# EAGLE design controller (EAGLE 6.4)
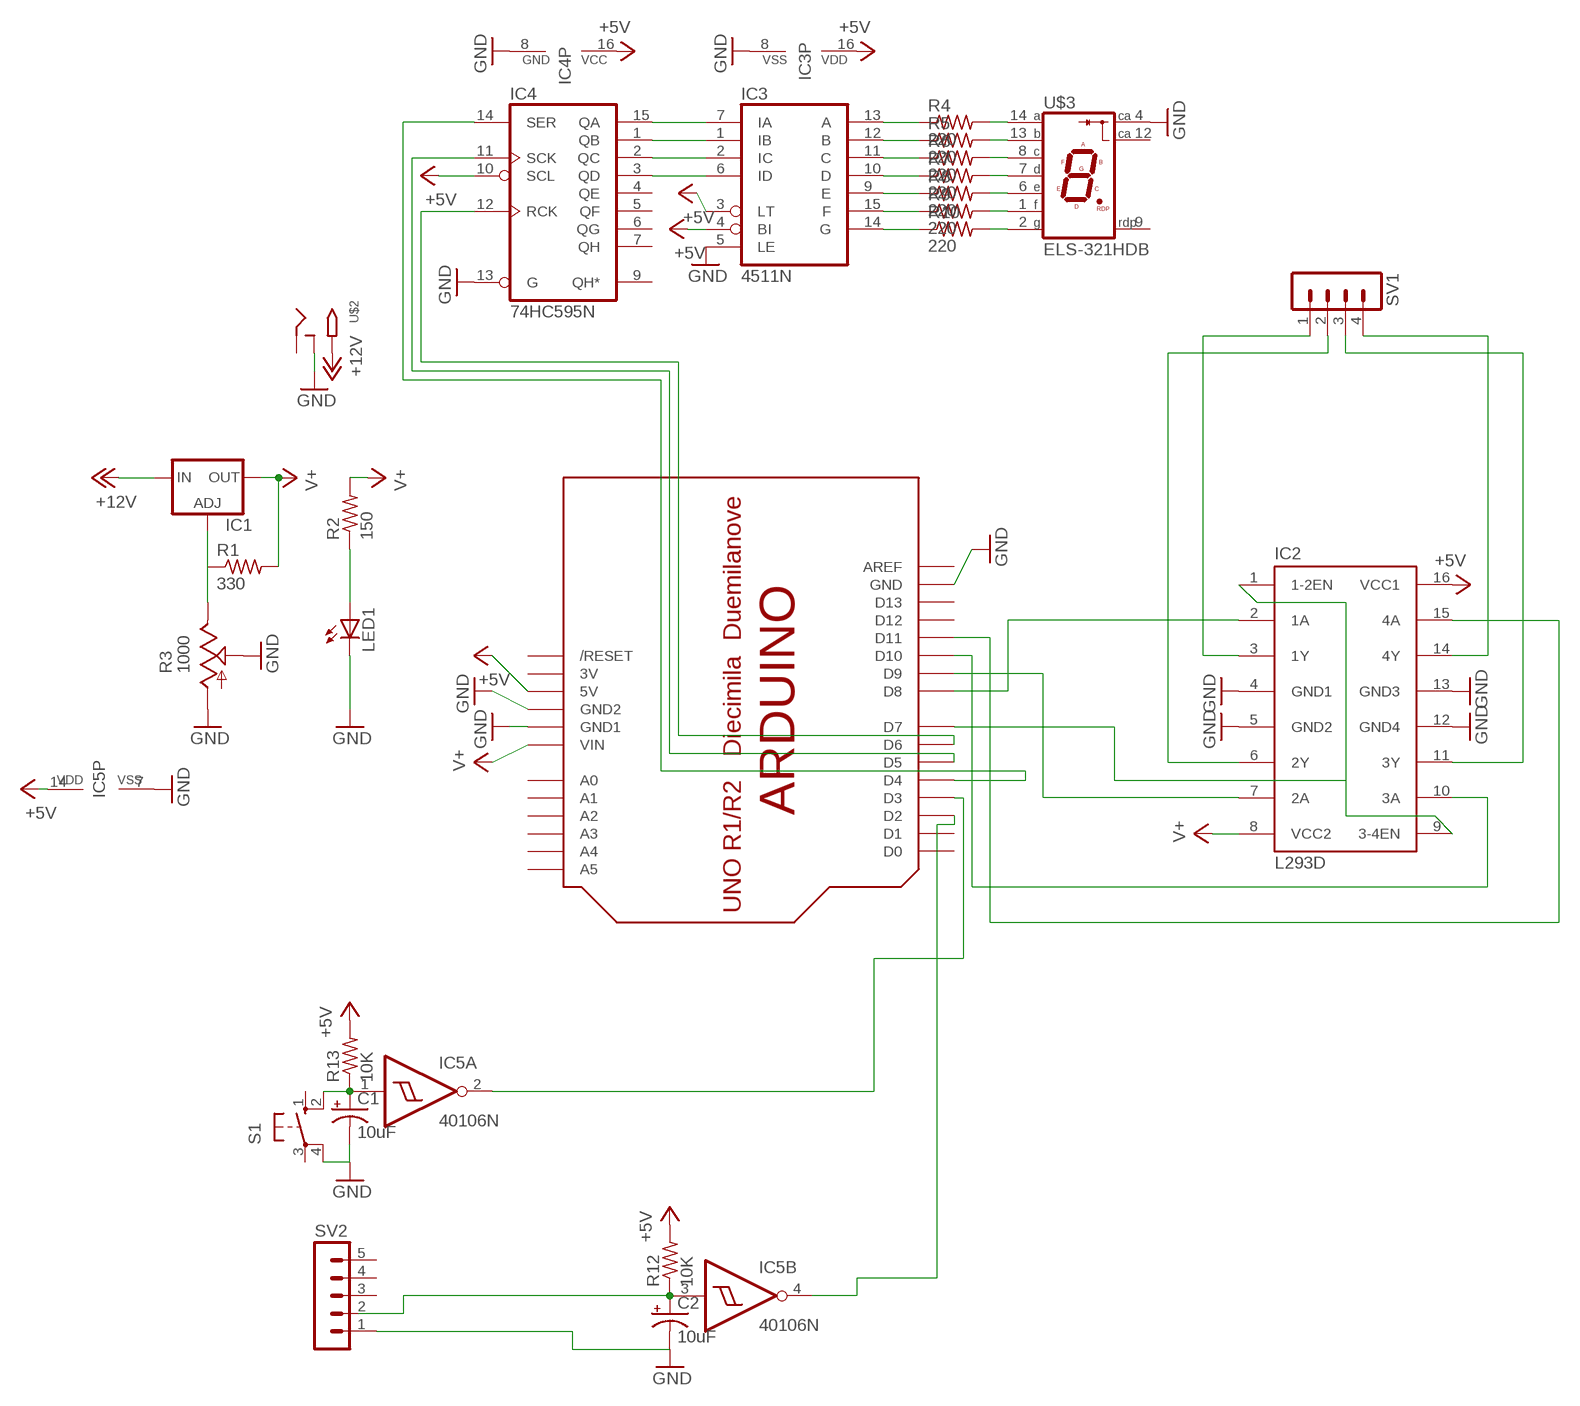
[diagram p0: schematic, sheet 1]

## Parts
C1  10uF  CPOL-USE2.5-5  [E2,5-5]
C2  10uF  CPOL-USE2.5-5  [E2,5-5]
IC1  LM317TS  [317TS]
IC2  L293D  [DIL16]
IC3  4511N  [DIL16]
IC4  74HC595N  [DIL16]
IC5  40106N  [DIL14]
LED1  LED5MM  [LED5MM]
R1  330  R-US_0207/10  [0207/10]
R2  150  R-US_0207/10  [0207/10]
R3  1000  TRIM_US-LI10  [LI10]
R4  220  R-US_0207/7  [0207/7]
R5  220  R-US_0207/7  [0207/7]
R6  220  R-US_0207/7  [0207/7]
R7  220  R-US_0207/7  [0207/7]
R8  220  R-US_0207/7  [0207/7]
R9  220  R-US_0207/7  [0207/7]
R10  220  R-US_0207/7  [0207/7]
R12  10K  R-US_0207/7  [0207/7]
R13  10K  R-US_0207/7  [0207/7]
S1  10-XX  [B3F-10XX]
SV1  MA04-1  [MA04-1]
SV2  MA05-1  [MA05-1]
U$1  ARDUINO-BPLACE  [ARDUINO-BPLACE]
U$2  2.1MMJACKTHM  [PJ-102A]
U$3  ELS-321HDB  [ELS-321HDB]

## Nets
+5V: IC2.16(VCC1) IC3.3(LT) IC3.4(BI) IC3.16(VDD) IC4.10(SCL) IC4.16(VCC) IC5.14(P:VDD) R12.2 R13.2 U$1.5V
+12V: IC1.3(IN) U$2.TIP
GND: C1.- C2.- IC2.4(GND1) IC2.5(GND2) IC2.12(GND4) IC2.13(GND3) IC3.5(LE) IC3.8(VSS) IC4.8(GND) IC4.13(G) IC5.7(P:VSS) LED1.K(C) R3.A R3.S S1.4(P1) SV2.1 U$1.GND U$1.GND1 U$1.GND2 U$2.RING_SW U$3.4(C)
N$1: IC1.1(ADJ) R1.1 R3.E
N$2: IC3.13(A) R4.1
N$3: LED1.A R2.1
N$4: IC2.3(1Y) SV1.1
N$5: IC2.6(2Y) SV1.2
N$6: IC2.11(3Y) SV1.3
N$7: IC2.14(4Y) SV1.4
N$8: IC2.2(1A) U$1.D8
N$9: IC2.7(2A) U$1.D9
N$10: IC2.10(3A) U$1.D10
N$11: IC2.15(4A) U$1.D11
N$12: IC3.12(B) R5.1
N$13: IC2.1(1-2EN) IC2.9(3-4EN) U$1.D7
N$14: IC3.11(C) R6.1
N$15: IC3.10(D) R7.1
N$16: IC3.9(E) R8.1
N$17: IC3.15(F) R9.1
N$18: IC3.14(G) R10.1
N$19: R4.2 U$3.14(A)
N$20: R5.2 U$3.13(B)
N$21: R6.2 U$3.8(C)
N$22: R7.2 U$3.7(D)
N$23: R8.2 U$3.6(E)
N$24: R9.2 U$3.1(F)
N$25: R10.2 U$3.2(G)
N$26: IC3.7(IA) IC4.15(QA)
N$27: IC3.1(IB) IC4.1(QB)
N$28: IC3.2(IC) IC4.2(QC)
N$29: IC3.6(ID) IC4.3(QD)
N$30: IC4.14(SER) U$1.D4
N$31: IC4.11(SCK) U$1.D5
N$32: IC4.12(RCK) U$1.D6
N$33: C1.+ IC5.1(A:I) R13.1 S1.2(S1)
N$34: IC5.2(A:O) U$1.D3
N$35: C2.+ IC5.3(B:I) R12.1 SV2.2
N$38: IC5.4(B:O) U$1.D2
V+: IC1.2(OUT) IC2.8(VCC2) R1.2 R2.2 U$1.VIN
Unconnected: IC4.4(QE) IC4.5(QF) IC4.6(QG) IC4.7(QH) IC4.9(QH*) IC5.5(C:I) IC5.6(C:O) IC5.8(D:O) IC5.9(D:I) IC5.10(E:O) IC5.11(E:I) IC5.12(F:O) IC5.13(F:I) S1.1(S) S1.3(P) SV2.3 SV2.4 SV2.5 U$1.A0 U$1.A1 U$1.A2 U$1.A3 U$1.A4 U$1.A5 U$1.AREF U$1.D0 U$1.D1 U$1.D12 U$1.D13 U$1.RESET(/RESET) U$2.RING U$3.9(RDP) U$3.12(C)

## Power pins joined to a net without a drawn wire
3V: U$1.3V

## Library data of the parts
C1 C2 = rcl:CPOL-US: POLARIZED CAPACITOR, American symbol
IC1 = v-reg:LM317TS: VOLTAGE REGULATOR
IC2 = st-microelectronics:L293D: PUSH-PULL 4 CHANNEL DRIVER; MPN: L293D; OC_FARNELL: 9589619; OC_NEWARK: 56P8249
IC3 = 45xx:4511: BCD to 7-segment LATCH/DECODER/DRIVER
IC4 = 74xx-eu:74*595: 8-bit SHIFT REGISTER, output latch
IC5 = 40xx:40106: Hex SCHMITT TRIGGER
LED1 = led:LED: LED OSRAM: - CHIPLED LG R971, LG N971, LY N971, LG Q971, LY Q971, LO R971, LY R971 LH N974, LH R974 LS Q976, LO Q976, LY Q976 LO Q996 - Hyper CHIPLED LW Q18S LB Q993, LB Q99A, LB R99A - SideLED LS A670, LO A670, LY A670, LG A670, LP A670 LB A673, LV A673, LT A673, LW A673 LH A674 LY A675 LS A676, LA A676, LO A676, LY A676, LW A676 LS A679, LY A679, LG A679 - Hyper Micro SIDELED® LS Y876, LA Y876, LO Y876, LY Y876 LT Y87S - SmartLED LW L88C, LW L88S LB L89C, LB L89S, LG L890 LS L89K, LO L89K, LY L89K LS L896, LA L896, LO L896, LY L896 - TOPLED LS T670, LO T670, LY T670, LG T670, LP T670 LSG T670, LSP T670, LSY T670, LOP T670, LYG T670 LG T671, LOG T671, LSG T671 LB T673, LV T673, LT T673, LW T673 LH T674 LS T676, LA T676, LO T676, LY T676, LB T676, LH T676, LSB T676, LW T676 LB T67C, LV T67C, LT T67C, LS T67K, LO T67K, LY T67K, LW E67C LS E67B, LA E67B, LO E67B, LY E67B, LB E67C, LV E67C, LT E67C LW T67C LS T679, LY T679, LG T679 LS T770, LO T770, LY T770, LG T770, LP T770 LB T773, LV T773, LT T773, LW T773 LH T774 LS E675, LA E675, LY E675, LS T675 LS T776, LA T776, LO T776, LY T776, LB T776 LHGB T686 LT T68C, LB T68C - Hyper Mini TOPLED® LB M676 - Mini TOPLED Santana® LG M470 LS M47K, LO M47K, LY M47K Source: http://www.osram.convergy.de LUXEON: - LUMILED® LXK2-PW12-R00, LXK2-PW12-S00, LXK2-PW14-U00, LXK2-PW14-V00 LXK2-PM12-R00, LXK2-PM12-S00, LXK2-PM14-U00 LXK2-PE12-Q00, LXK2-PE12-R00, LXK2-PE12-S00, LXK2-PE14-T00, LXK2-PE14-U00 LXK2-PB12-K00, LXK2-PB12-L00, LXK2-PB12-M00, LXK2-PB14-N00, LXK2-PB14-P00, LXK2-PB14-Q00 LXK2-PR12-L00, LXK2-PR12-M00, LXK2-PR14-Q00, LXK2-PR14-R00 LXK2-PD12-Q00, LXK2-PD12-R00, LXK2-PD12-S00 LXK2-PH12-R00, LXK2-PH12-S00 LXK2-PL12-P00, LXK2-PL12-Q00, LXK2-PL12-R00 Source: www.luxeon.com KINGBRIGHT: KA-3528ASYC Source: www.kingbright.com
R1 R2 = resistor:R-US_: RESISTOR, American symbol
R3 = pot:TRIM_US-: POTENTIOMETER
R4-R10 R12 R13 = adafruit:R-US_: RESISTOR, American symbol
S1 = switch-omron:10-XX: OMRON SWITCH; MPN: B3F-1000; OC_FARNELL: 176432; OC_NEWARK: 36M3542
SV1 = con-lstb:MA04-1: PIN HEADER; OC_FARNELL: unknown; OC_NEWARK: unknown
SV2 = con-lstb:MA05-1: PIN HEADER; OC_FARNELL: unknown; OC_NEWARK: unknown
U$1 = adafruit:ARDUINO: Arduino Diecimila/Duemilanove Make a shield with ease, this package has all the named pins as well as the two mounting drill holes and an outline of the USB and DC power connector. The outline is on the DIMENSION layer, so if your board house uses it they will cut the outline to match. http://www.ladyada.net/library/pcb/eaglelibrary.html
U$2 = adafruit:2.1MMJACK: 2.1mm x 5.5mm THM DC jack with internal switch. Digikey part #PJ-102A, 4UCON part #05537 2.1mm x 5.5mm SMT DC jack with internal switch. Digikey part #PJ-002A-SMT, 4UCON part #03267 By microbuilder.eu & adafruit.com
U$3 = national-semiconductor:ELS-321HDB: Common Cathode 7-Segment Display

## Board
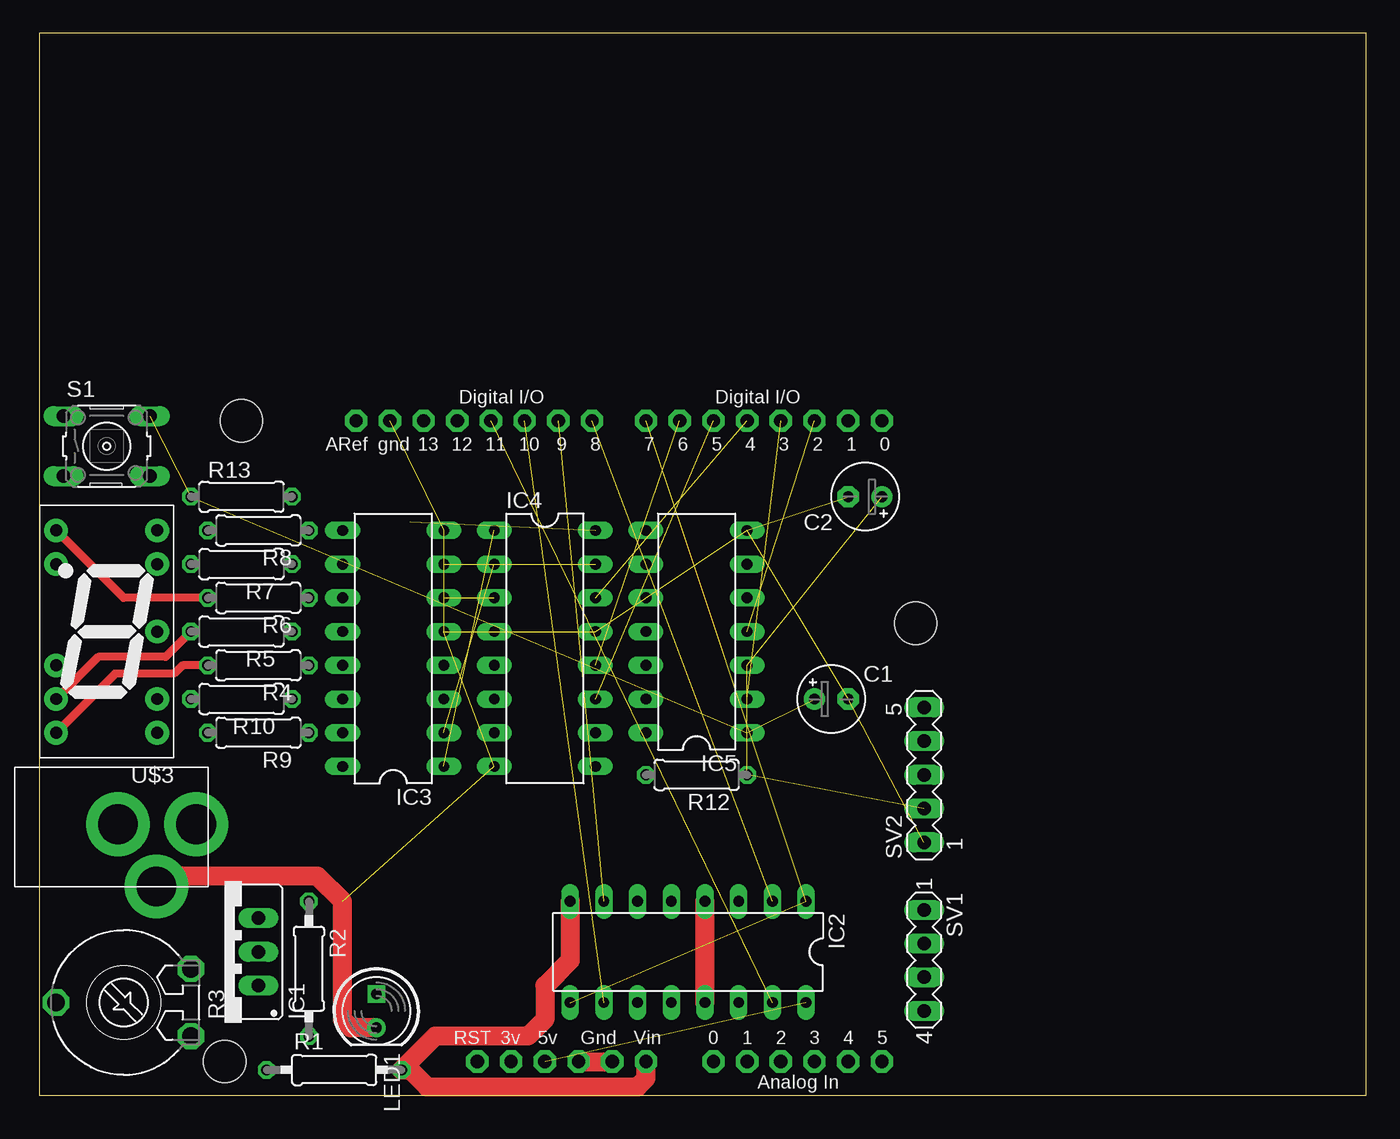
[diagram p1: board, top side]
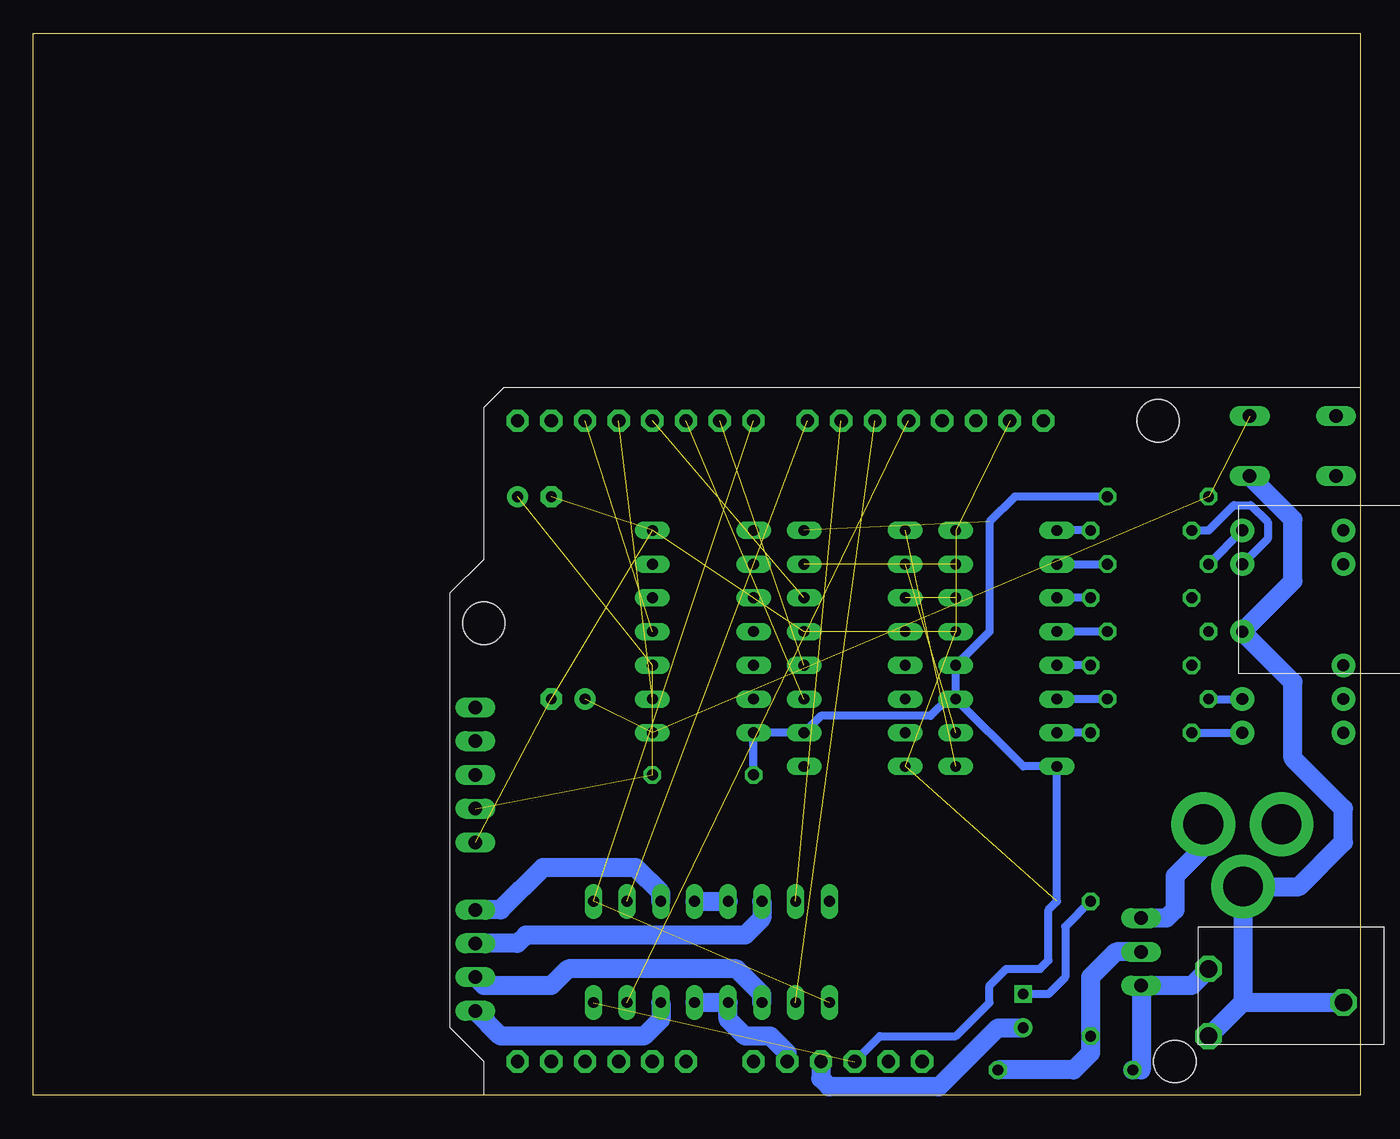
[diagram p2: board, bottom side, seen from below]

Size 100 x 80 mm. Coordinates in mm from the lower left corner, seen from the top.
Outline: 0,0 100,0 100,80 0,80 0,0
Copper layers (1*16): Top 0.035mm / dielectric 1.5mm / Bottom 0.035mm
Design rules "default": minimum track width 10mil, minimum drill 24mil, track to track 8mil, track to pad 8mil, pad to pad 8mil, via to via 8mil, smd to smd 8mil, copper to edge 40mil, drill to drill 8mil, minimum pad ring 10mil, minimum via ring 8mil, stop-mask expansion 4mil, vias tented up to drill 0mil, thermal gap 10mil

### Footprints (pad centres in the part's own frame; a part is rotated, then mirrored left to right if it is on the bottom)
E2,5-5 = drill 0.813 pad 1.6: + -1.27,0 | drill 0.813 pad 1.6 octagon: - 1.27,0
317TS = drill 1.016 long: 1 -2.54,-2.54; 2 0,-2.54; 3 2.54,-2.54
DIL16 = drill 0.813 long: 1 -8.89,-3.81; 2 -6.35,-3.81; 3 -3.81,-3.81; 4 -1.27,-3.81; 5 1.27,-3.81; 6 3.81,-3.81; 7 6.35,-3.81; 8 8.89,-3.81; 9 8.89,3.81; 10 6.35,3.81; 11 3.81,3.81; 12 1.27,3.81; 13 -1.27,3.81; 14 -3.81,3.81; 15 -6.35,3.81; 16 -8.89,3.81
DIL14 = drill 0.813 long: 1 -7.62,-3.81; 2 -5.08,-3.81; 3 -2.54,-3.81; 4 0,-3.81; 5 2.54,-3.81; 6 5.08,-3.81; 7 7.62,-3.81; 8 7.62,3.81; 9 5.08,3.81; 10 2.54,3.81; 11 0,3.81; 12 -2.54,3.81; 13 -5.08,3.81; 14 -7.62,3.81
LED5MM = drill 0.813 square: A -1.27,0 | drill 0.813 pad 1.422: K 1.27,0
0207/10 = drill 0.813 octagon: 1 -5.08,0; 2 5.08,0
LI10 = drill 1.321 octagon: A -2.54,-5.08; E 2.54,-5.08; S 0,5.08
0207/7 = drill 0.813 octagon: 1 -3.81,0; 2 3.81,0
B3F-10XX = drill 1.016 long: 1 -3.251,2.261; 2 3.251,2.261; 3 -3.251,-2.261; 4 3.251,-2.261
MA04-1 = drill 1.016 long: 1 -3.81,0; 2 -1.27,0; 3 1.27,0; 4 3.81,0
MA05-1 = drill 1.016 long: 1 -5.08,0; 2 -2.54,0; 3 0,0; 4 2.54,0; 5 5.08,0
ARDUINO-BPLACE = drill 1 pad 1.676 octagon: 3V 35.56,2.54; 5V 38.1,2.54; A0 50.8,2.54; A1 53.34,2.54; A2 55.88,2.54; A3 58.42,2.54; A4 60.96,2.54; A5 63.5,2.54; AREF 23.876,50.8; D0 63.5,50.8; D1 60.96,50.8; D2 58.42,50.8; D3 55.88,50.8; D4 53.34,50.8; D5 50.8,50.8; D6 48.26,50.8; D7 45.72,50.8; D8 41.656,50.8; D9 39.116,50.8; D10 36.576,50.8; D11 34.036,50.8; D12 31.496,50.8; D13 28.956,50.8; GND 26.416,50.8; GND1 43.18,2.54; GND2 40.64,2.54; RESET 33.02,2.54; VIN 45.72,2.54 | hole 3.2: 15.24,50.8; 66.04,35.56; 13.97,2.54
PJ-102A = drill 3 pad 4.8: RING 0.1,-3.39; RING_SW -4.6,-6.29; TIP 0.1,-9.29
ELS-321HDB = drill 0.9 pad 1.778: 1 -3.81,7.62; 2 -3.81,5.08; 4 -3.81,0; 6 -3.81,-5.08; 7 -3.81,-7.62; 8 3.81,-7.62; 9 3.81,-5.08; 12 3.81,2.54; 13 3.81,5.08; 14 3.81,7.62

### Placement (x,y rotation side)
C1  59.69,29.84 0 top
C2  62.23,45.09 180 top
IC1  13.97,10.79 90 top
IC2  48.9,10.79 180 top
IC3  26.67,33.66 90 top
IC4  38.1,33.66 270 top
IC5  49.53,34.92 90 top
LED1  25.4,6.35 270 top
R1  22.23,1.91 0 top
R2  20.32,9.53 270 top
R3  6.35,6.99 90 top
R4  16.51,32.38 180 top
R5  15.24,34.92 180 top
R6  16.51,37.47 180 top
R7  15.24,40.01 180 top
R8  16.51,42.55 180 top
R9  16.51,27.3 180 top
R10  15.24,29.84 180 top
R12  49.53,24.13 180 top
R13  15.24,45.09 0 top
S1  5.08,48.9 0 top
SV1  66.67,10.16 270 top
SV2  66.67,24.13 90 top
U$1  0,0 0 top
U$2  2.54,20.32 90 top
U$3  5.08,34.92 180 top

### Tracks (layer width: path | path; a pad name or v marks a point on that pad's centre or on a via)
+5V  (2 unrouted)
  Bottom 0.61: U$1.5V 36.2,4.45 30.48,4.45 27.94,6.99 27.94,8.26 26.67,9.53 24.13,9.53 23.5,10.16 23.5,13.97 22.86,14.61 IC3.16 25.4,24.77 IC3.3 | IC3.3 IC3.4 27.94,34.92 27.94,43.18 26.04,45.09 R13.2 | IC3.3 31.11,29.84 32.38,28.57 40.64,28.57 IC4.10 IC5.14 R12.2
+12V
  Bottom 1.422: U$2.TIP 11.83,18.65 13.97,16.51 13.97,13.97 14.61,13.34 IC1.3
GND  (9 unrouted)
  Top 1.422: LED1.K 23.5,5.08 22.86,5.71 22.86,14.61 20.95,16.51 9.62,16.51 U$2.RING_SW | U$1.GND2 U$1.GND1 | IC2.13 IC2.4
  Bottom 1.422: R3.S 8.89,6.99 R3.A 8.83,7.04 U$2.RING_SW 4.6,15.72 1.27,19.05 1.27,21.59 5.08,25.4 5.08,31.11 U$3.4 5.08,38.73 5.08,43.38 S1.4 | U$1.GND2 40.64,1.27 40.01,0.64 31.75,0.64 27.3,5.08 LED1.K | U$1.GND1 43.18,3.17 44.45,4.45 46.35,4.45 47.62,5.71 IC2.12 IC2.13 | IC2.4 IC2.5
N$1
  Bottom 1.422: R3.E 12.7,8.26 IC1.1 16.51,1.91 R1.1
N$2
  Bottom 0.61: R4.1 IC3.13
N$3
  Bottom 0.61: R2.1 22.23,12.7 22.23,8.89 23.5,7.62 LED1.A
N$4
  Bottom 1.422: IC2.3 52.7,15.24 54.61,17.14 61.59,17.14 64.77,13.97 SV1.1
N$5
  Bottom 1.422: IC2.6 45.09,13.34 46.35,12.06 62.87,12.06 63.5,11.43 SV1.2
N$6
  Bottom 1.422: IC2.11 45.09,7.62 46.99,9.53 59.69,9.53 60.96,8.26 66.04,8.26 SV1.3
N$7
  Bottom 1.422: IC2.14 52.7,5.71 53.98,4.45 64.77,4.45 SV1.4
N$8  (1 unrouted)
N$9  (1 unrouted)
N$10  (1 unrouted)
N$11  (1 unrouted)
N$12
  Bottom 0.61: R5.1 IC3.12
N$13  (2 unrouted)
N$14
  Bottom 0.61: R6.1 IC3.11
N$15
  Bottom 0.61: IC3.10 R7.1
N$16
  Bottom 0.61: R8.1 IC3.9
N$17
  Bottom 0.61: R9.1 IC3.15
N$18
  Bottom 0.61: R10.1 IC3.14
N$19
  Top 0.61: R4.2 10.79,32.38 10.16,31.75 5.71,31.75 U$3.14
N$20
  Top 0.61: R5.2 9.53,33.02 4.45,33.02 U$3.13
N$21
  Top 0.61: R6.2 6.35,37.47 U$3.8
N$22
  Bottom 0.61: R7.2 U$3.7
N$23
  Bottom 0.61: R8.2 11.43,42.55 9.53,44.45 8.26,44.45 6.99,43.18 6.99,41.91 U$3.6
N$24
  Bottom 0.61: R9.2 U$3.1
N$25
  Bottom 0.61: R10.2 U$3.2
N$26  (1 unrouted)
N$27  (1 unrouted)
N$28  (1 unrouted)
N$29  (1 unrouted)
N$30  (1 unrouted)
N$31  (1 unrouted)
N$32  (1 unrouted)
N$33  (3 unrouted)
N$34  (1 unrouted)
N$35  (3 unrouted)
N$38  (1 unrouted)
V+
  Top 1.422: U$1.VIN 45.72,1.27 45.09,0.64 29.21,0.64 27.94,1.91 R1.2 29.84,4.45 36.83,4.45 38.1,5.71 38.1,8.26 40.01,10.16 IC2.8
  Bottom 1.422: IC1.2 18.41,10.79 20.32,8.89 R2.2 20.32,3.17 21.59,1.91 R1.2